# Altium schematic sheet io.SchDoc
size Letter
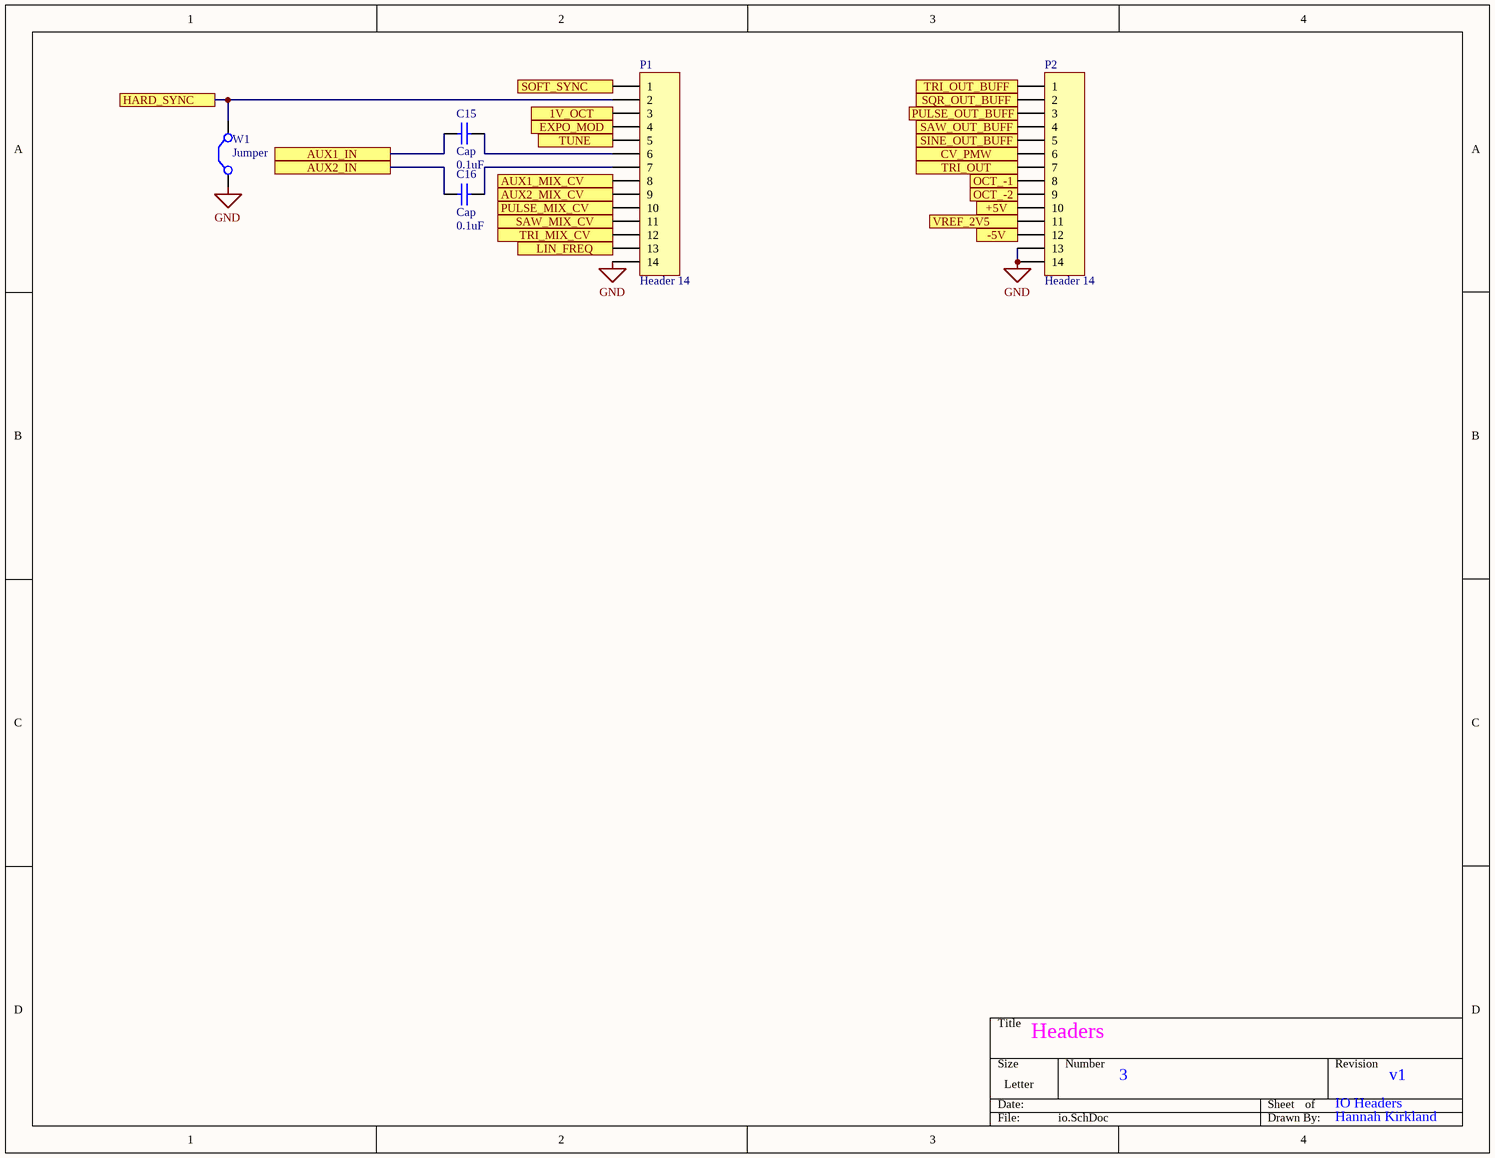
[diagram p0: io.SchDoc]

## Parts
C15  Cap  value 0.1uF  [C1206]
C16  Cap  value 0.1uF  [C1206]
P1  Header 14  [HDR1X14]
P2  Header 14  [HDR1X14]
W1  Jumper  [0603]

## Ports
1V_OCT, +5V, -5V, AUX1_IN, AUX1_MIX_CV, AUX2_IN, AUX2_MIX_CV, CV_PMW, EXPO_MOD, HARD_SYNC, LIN_FREQ, OCT_-1, OCT_-2, PULSE_MIX_CV, PULSE_OUT_BUFF, SAW_MIX_CV, SAW_OUT_BUFF, SINE_OUT_BUFF, SOFT_SYNC, SQR_OUT_BUFF, TRI_MIX_CV, TRI_OUT, TRI_OUT_BUFF, TUNE, VREF_2V5

## Nets
GND: P1.14 P2.13 P2.14 W1.1(C1)
1V_OCT: P1.3 ; port 1V_OCT
+5V: P2.10 ; port +5V
-5V: P2.12 ; port -5V
AUX1_IN: C15.1 ; port AUX1_IN
AUX1_MIX_CV: P1.8 ; port AUX1_MIX_CV
AUX2_IN: C16.1 ; port AUX2_IN
AUX2_MIX_CV: P1.9 ; port AUX2_MIX_CV
CV_PMW: P2.6 ; port CV_PMW
EXPO_MOD: P1.4 ; port EXPO_MOD
HARD_SYNC: P1.2 W1.2(C2) ; port HARD_SYNC
LIN_FREQ: P1.13 ; port LIN_FREQ
OCT_-1: P2.8 ; port OCT_-1
OCT_-2: P2.9 ; port OCT_-2
PULSE_MIX_CV: P1.10 ; port PULSE_MIX_CV
PULSE_OUT_BUFF: P2.3 ; port PULSE_OUT_BUFF
SAW_MIX_CV: P1.11 ; port SAW_MIX_CV
SAW_OUT_BUFF: P2.4 ; port SAW_OUT_BUFF
SINE_OUT_BUFF: P2.5 ; port SINE_OUT_BUFF
SOFT_SYNC: P1.1 ; port SOFT_SYNC
SQR_OUT_BUFF: P2.2 ; port SQR_OUT_BUFF
TRI_MIX_CV: P1.12 ; port TRI_MIX_CV
TRI_OUT: P2.7 ; port TRI_OUT
TRI_OUT_BUFF: P2.1 ; port TRI_OUT_BUFF
TUNE: P1.5 ; port TUNE
VREF_2V5: P2.11 ; port VREF_2V5
NetC15_2: C15.2 P1.6
NetC16_2: C16.2 P1.7

## Notes on the sheet
- Headers
- 3
- IO Headers
- v1
- Hannah Kirkland

## Library data of the parts
C15 C16 = Cap: Capacitor; Published: 8-Jun-2000; LatestRevisionDate: 17-Jul-2002; LatestRevisionNote: Re-released for DXP Platform.; PackageReference: RAD-0.3; Publisher: Altium Limited; PackageDescription: Radial Cap, Thru-Hole; 2 Leads; 0.3 in Pin Spacing
P1 P2 = Header 14: Header, 14-Pin; LatestRevisionDate: 17-Jul-2002; LatestRevisionNote: Re-released for DXP Platform.; Publisher: Altium Limited
W1 = Jumper: Jumper Wire; Published: 24-Mar-1999; LatestRevisionDate: 17-Jul-2002; LatestRevisionNote: Re-released for DXP Platform.; PackageReference: RAD-0.2; Publisher: Altium Limited; PackageDescription: Radial Cap, Thru-Hole; 2 Leads; 0.2 in Pin Spacing